# EAGLE design tea_maker_without_autorouter (EAGLE 7.3.0)
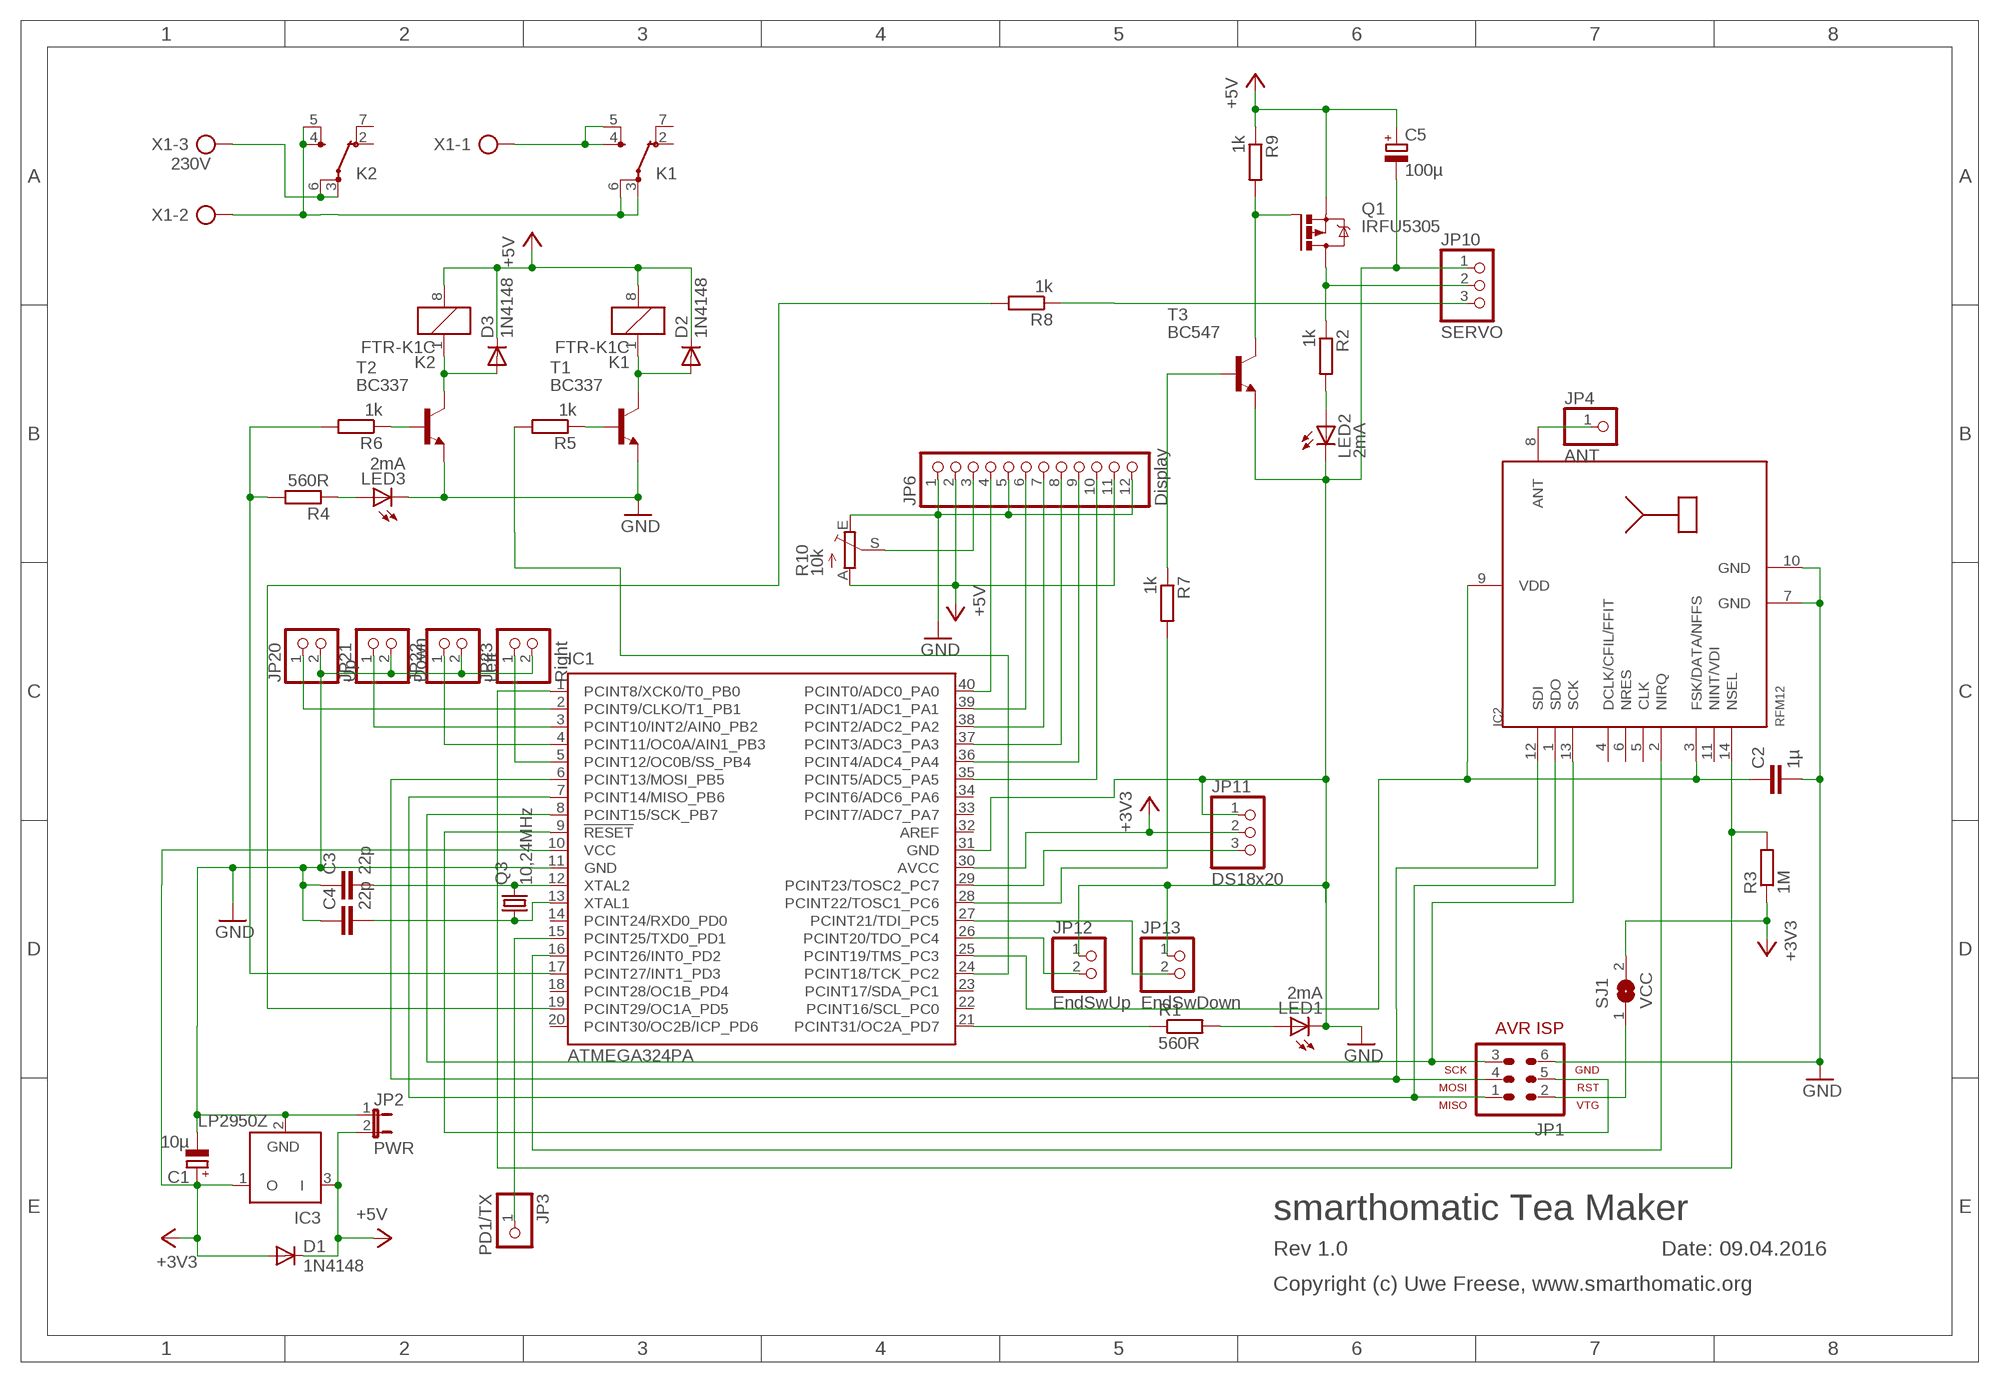
[diagram p0: schematic, sheet 1]

## Parts
C1  10µ  CPOL-EUE1.8-4  [E1,8-4]
C2  1µ  C5/3.5  [C5B3.5]
C3  22p  C-EU025-024X044  [C025-024X044]
C4  22p  C-EU025-024X044  [C025-024X044]
C5  100µ  CPOL-EUE2.5-7  [E2,5-7]
D1  1N4148  1N4148DO35-7  [DO35-7]
D2  1N4148  1N4148DO35-7  [DO35-7]
D3  1N4148  1N4148DO35-7  [DO35-7]
IC1  ATMEGA324PA  ATMEGA644-10PU  [DIL40]
IC2  RFM12  [RFM]
IC3  LP2950Z  [TO92]
JP1  AVR-ISP-6  [AVR-ISP-6]
JP2  PWR  JP1E  [JP1]
JP3  PD1/TX  PINHD-1X1  [1X01]
JP4  ANT  PINHD-1X1  [1X01]
JP6  Display  PINHD-1X12  [1X12]
JP10  SERVO  PINHD-1X3  [1X03]
JP11  DS18x20  PINHD-1X3  [1X03]
JP12  EndSwUp  PINHD-1X2  [1X02]
JP13  EndSwDown  PINHD-1X2  [1X02]
JP20  Up  PINHD-1X2  [1X02]
JP21  Down  PINHD-1X2  [1X02]
JP22  Left  PINHD-1X2  [1X02]
JP23  Right  PINHD-1X2  [1X02]
K1  FTR-K1C  [FTR-K1C]
K2  FTR-K1C  [FTR-K1C]
LED1  2mA  LED3MM  [LED3MM]
LED2  2mA  LED3MM  [LED3MM]
LED3  2mA  LED3MM  [LED3MM]
Q1  IRFU5305  [I-PAK_TO251AA]
Q3  10,24MHz  CRYSTALHC49S  [HC49/S]
R1  560R  R-EU_0207/7  [0207/7]
R2  1k  R-EU_0207/7  [0207/7]
R3  1M  R-EU_0207/7  [0207/7]
R4  560R  R-EU_0207/7  [0207/7]
R5  1k  R-EU_0207/7  [0207/7]
R6  1k  R-EU_0207/7  [0207/7]
R7  1k  R-EU_0207/7  [0207/7]
R8  1k  R-EU_0207/7  [0207/7]
R9  1k  R-EU_0207/7  [0207/7]
R10  10k  TRIM_EU-PT10S  [PT-10S]
SJ1  VCC  SJ  [SJ]
T1  BC337  [TO92]
T2  BC337  [TO92]
T3  BC547  [TO92]
X1  230V  AK500/3  [AK500/3]

## Nets
+3V3: C1.+ D1.A IC1.10(VCC) IC1.30(AVCC) IC3.1(O) JP11.2 R3.1 SJ1.2
+5V: C5.+ D1.C D2.C D3.C IC3.3(I) JP2.2 JP6.2 JP6.11 K1.8 K2.8 Q1.3(S) R9.1 R10.A
GND: C1.- C2.2 C3.1 C4.1 C5.- IC1.11(GND) IC1.31(GND) IC2.7(GND) IC2.10(GND) IC3.2(GND) JP1.6 JP2.1 JP6.1 JP6.5 JP6.12 JP10.1 JP11.1 JP12.1 JP13.1 JP20.2 JP21.2 JP22.2 JP23.2 LED1.K(C) LED2.K(C) LED3.K(C) R10.E T1.1(E) T2.1(E) T3.1(E)
N$1: IC1.2(PCINT9/CLKO/T1_PB1) JP20.1
N$2: JP1.2 SJ1.1
N$3: IC1.6(PCINT13/MOSI_PB5) IC2.12(SDI) JP1.4
N$4: IC1.7(PCINT14/MISO_PB6) IC2.1(SDO) JP1.1
N$5: IC1.8(PCINT15/SCK_PB7) IC2.13(SCK) JP1.3
N$6: IC1.21(PCINT31/OC2A_PD7) R1.1
N$7: R5.1 T1.2(B)
N$8: IC1.9(!RESET) JP1.5
N$9: D2.A K1.1 T1.3(C)
N$10: IC1.3(PCINT10/INT2/AIN0_PB2) JP21.1
N$11: IC2.8(ANT) JP4.1
N$12: LED1.A R1.2
N$13: IC1.1(PCINT8/XCK0/T0_PB0) IC2.14(NSEL) R3.2
N$14: LED3.A R4.1
N$15: IC1.16(PCINT26/INT0_PD2) IC2.2(NIRQ)
N$16: IC1.4(PCINT11/OC0A/AIN1_PB3) JP22.1
N$17: IC1.5(PCINT12/OC0B/SS_PB4) JP23.1
N$18: K1.4(-1:SA) K1.5(-1:SB) X1.1
N$19: IC1.40(PCINT0/ADC0_PA0) JP6.4
N$20: IC1.15(PCINT25/TXD0_PD1) JP3.1
N$21: K2.3(-1:PA) K2.6(-1:PB) X1.3
N$22: C2.1 IC1.25(PCINT19/TMS_PC3) IC2.3(FSK/DATA/NFFS) IC2.9(VDD)
N$23: IC1.39(PCINT1/ADC1_PA1) JP6.6
N$25: IC1.24(PCINT18/TCK_PC2) R5.2
N$26: R6.1 T2.2(B)
N$27: IC1.38(PCINT2/ADC2_PA2) JP6.7
N$28: IC1.37(PCINT3/ADC3_PA3) JP6.8
N$29: IC1.36(PCINT4/ADC4_PA4) JP6.9
N$30: IC1.35(PCINT5/ADC5_PA5) JP6.10
N$31: LED2.A R2.2
N$32: IC1.28(PCINT22/TOSC1_PC6) R7.2
N$33: JP6.3 R10.S
N$34: R7.1 T3.2(B)
N$35: Q1.1(G) R9.2 T3.3(C)
N$36: JP10.2 Q1.2(D) R2.1
N$37: K1.3(-1:PA) K1.6(-1:PB) K2.4(-1:SA) K2.5(-1:SB) X1.2
N$38: JP10.3 R8.1
N$39: IC1.19(PCINT29/OC1A_PD5) R8.2
N$40: C3.2 IC1.12(XTAL2) Q3.2
N$41: C4.2 IC1.13(XTAL1) Q3.1
N$42: IC1.29(PCINT23/TOSC2_PC7) JP11.3
N$45: D3.A K2.1 T2.3(C)
N$47: IC1.26(PCINT20/TDO_PC4) JP12.2
N$48: IC1.17(PCINT27/INT1_PD3) R4.2 R6.2
N$49: IC1.27(PCINT21/TDI_PC5) JP13.2
Unconnected: IC1.14(PCINT24/RXD0_PD0) IC1.18(PCINT28/OC1B_PD4) IC1.20(PCINT30/OC2B/ICP_PD6) IC1.22(PCINT16/SCL_PC0) IC1.23(PCINT17/SDA_PC1) IC1.32(AREF) IC1.33(PCINT7/ADC7_PA7) IC1.34(PCINT6/ADC6_PA6) IC2.4(DCLK/CFIL/FFIT) IC2.5(CLK) IC2.6(NRES) IC2.11(NINT/VDI) K1.2(-1:OA) K1.7(-1:OB) K2.2(-1:OA) K2.7(-1:OB)

## Notes on the sheet
- smarthomatic Tea Maker
- Rev 1.0 | Date: 09.04.2016
- Copyright (c) Uwe Freese, www.smarthomatic.org

## Library data of the parts
C1 C5 = rcl:CPOL-EU: POLARIZED CAPACITOR, European symbol
C2 = capacitor-wima:C: CAPACITOR naming: grid - package width
C3 C4 = rcl:C-EU: CAPACITOR, European symbol
D1-D3 = diode:1N4148: DIODE high speed (Philips)
IC1 = atmel:ATMEGA644-*PU: 8-bit Microcontroller with 64K Bytes In-System Programmable Flash Auto generated by make-symbol-device-package-bsdl.ulp Rev. 34 Source: http://www.atmel.com/dyn/resources/prod_documents/doc2593.pdf; MPN: ATMEGA644V-10PU; OC_FARNELL: 1288342; OC_NEWARK: 23M5062
IC2 = hopeRF:RFM12
IC3 = linear:LP2950: 100 mA, Low Power Low Dropout Voltage Regulator Source: http://www.onsemi.com/pub/Collateral/LP2950-D.PDF
JP1 = avr-5-4.16:AVR-ISP-6: AVR ISP-6 Serial Programming Header
JP2 = jumper:JP1E: JUMPER
JP3 JP4 = pinhead:PINHD-1X1: PIN HEADER
JP6 = pinhead:PINHD-1X12: PIN HEADER
JP10 JP11 = pinhead:PINHD-1X3: PIN HEADER
JP12 JP13 JP20-JP23 = pinhead:PINHD-1X2: PIN HEADER
K1 K2 = relay:FTR-K1C: NETZRELAIS FTR-K1CK024W1XUM 16A/250VAC 1 Umschaltkontakt Distributor: Conrad Electronic Bestell Nr.: 504389-13 - 24V Source: http://www.produktinfo.conrad.com/datenblaetter/500000-524999/504384-da-01-de-NETZRELAIS_FTR_K1CK012W1XUM_16A_250VAC.pdf; OC_FARNELL: unknown; OC_NEWARK: unknown
LED1-LED3 = led:LED: LED OSRAM: - CHIPLED LG R971, LG N971, LY N971, LG Q971, LY Q971, LO R971, LY R971 LH N974, LH R974 LS Q976, LO Q976, LY Q976 LO Q996 - Hyper CHIPLED LW Q18S LB Q993, LB Q99A, LB R99A - SideLED LS A670, LO A670, LY A670, LG A670, LP A670 LB A673, LV A673, LT A673, LW A673 LH A674 LY A675 LS A676, LA A676, LO A676, LY A676, LW A676 LS A679, LY A679, LG A679 - Hyper Micro SIDELED® LS Y876, LA Y876, LO Y876, LY Y876 LT Y87S - SmartLED LW L88C, LW L88S LB L89C, LB L89S, LG L890 LS L89K, LO L89K, LY L89K LS L896, LA L896, LO L896, LY L896 - TOPLED LS T670, LO T670, LY T670, LG T670, LP T670 LSG T670, LSP T670, LSY T670, LOP T670, LYG T670 LG T671, LOG T671, LSG T671 LB T673, LV T673, LT T673, LW T673 LH T674 LS T676, LA T676, LO T676, LY T676, LB T676, LH T676, LSB T676, LW T676 LB T67C, LV T67C, LT T67C, LS T67K, LO T67K, LY T67K, LW E67C LS E67B, LA E67B, LO E67B, LY E67B, LB E67C, LV E67C, LT E67C LW T67C LS T679, LY T679, LG T679 LS T770, LO T770, LY T770, LG T770, LP T770 LB T773, LV T773, LT T773, LW T773 LH T774 LS E675, LA E675, LY E675, LS T675 LS T776, LA T776, LO T776, LY T776, LB T776 LHGB T686 LT T68C, LB T68C - Hyper Mini TOPLED® LB M676 - Mini TOPLED Santana® LG M470 LS M47K, LO M47K, LY M47K Source: http://www.osram.convergy.de LUXEON: - LUMILED® LXK2-PW12-R00, LXK2-PW12-S00, LXK2-PW14-U00, LXK2-PW14-V00 LXK2-PM12-R00, LXK2-PM12-S00, LXK2-PM14-U00 LXK2-PE12-Q00, LXK2-PE12-R00, LXK2-PE12-S00, LXK2-PE14-T00, LXK2-PE14-U00 LXK2-PB12-K00, LXK2-PB12-L00, LXK2-PB12-M00, LXK2-PB14-N00, LXK2-PB14-P00, LXK2-PB14-Q00 LXK2-PR12-L00, LXK2-PR12-M00, LXK2-PR14-Q00, LXK2-PR14-R00 LXK2-PD12-Q00, LXK2-PD12-R00, LXK2-PD12-S00 LXK2-PH12-R00, LXK2-PH12-S00 LXK2-PL12-P00, LXK2-PL12-Q00, LXK2-PL12-R00 Source: www.luxeon.com KINGBRIGHT: KA-3528ASYC Source: www.kingbright.com
Q1 = transistor-power:IRF?5305: HEXFET Power MOSFET Source: http://www.irf.com/product-info/datasheets/data/irfr5305pbf.pdf
Q3 = crystal:CRYSTAL: CRYSTAL; OC_FARNELL: 1667008; OC_NEWARK: unknown
R1-R9 = rcl:R-EU_: RESISTOR, European symbol
R10 = pot:TRIM_EU-: POTENTIOMETER
SJ1 = jumper:SJ: SMD solder JUMPER
T1 T2 = transistor-neu-to92:BC337: NPN TRANSISTOR
T3 = transistor-neu-to92:BC547: NPN TRANSISTOR
X1 = con-ptr500:AK500/3: CONNECTOR; OC_FARNELL: unknown; OC_NEWARK: unknown

## Net classes
0 default: clearance 0.305 mm

## Board
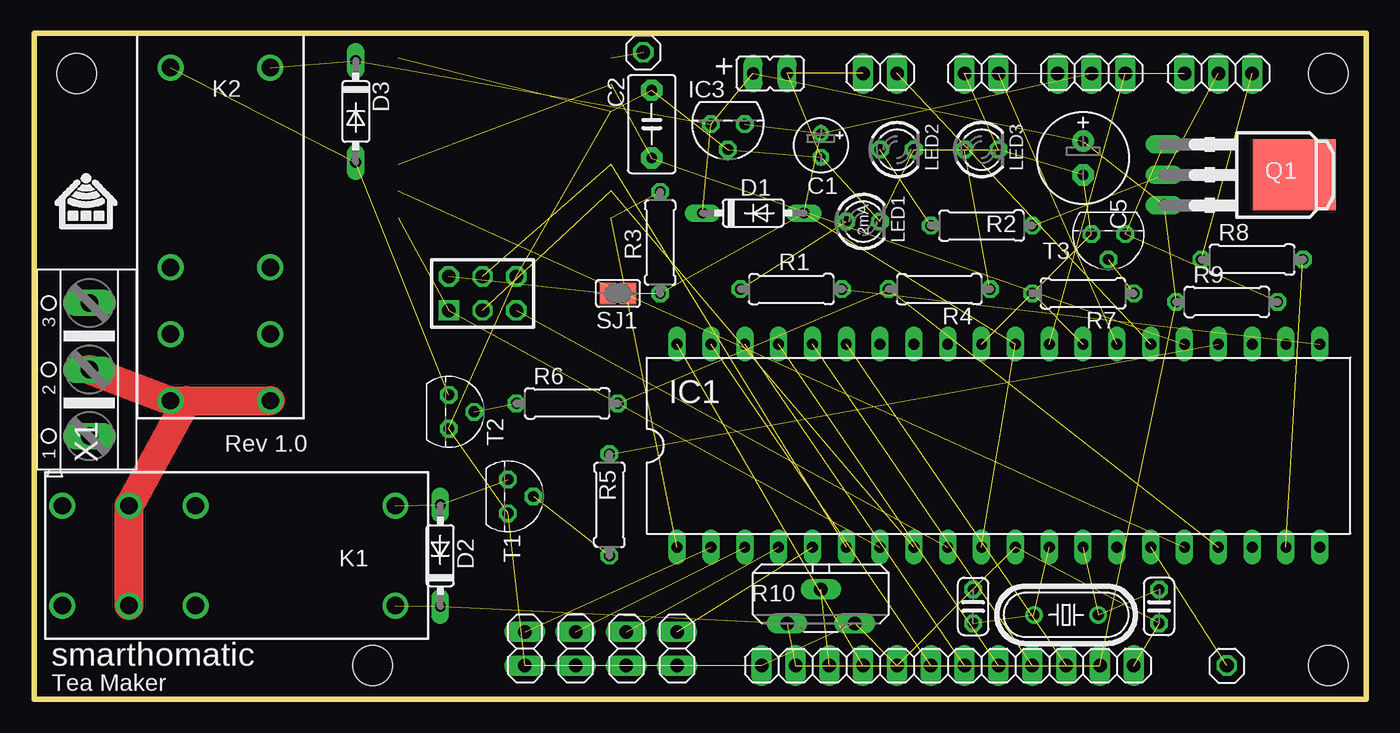
[diagram p1: board, top side]
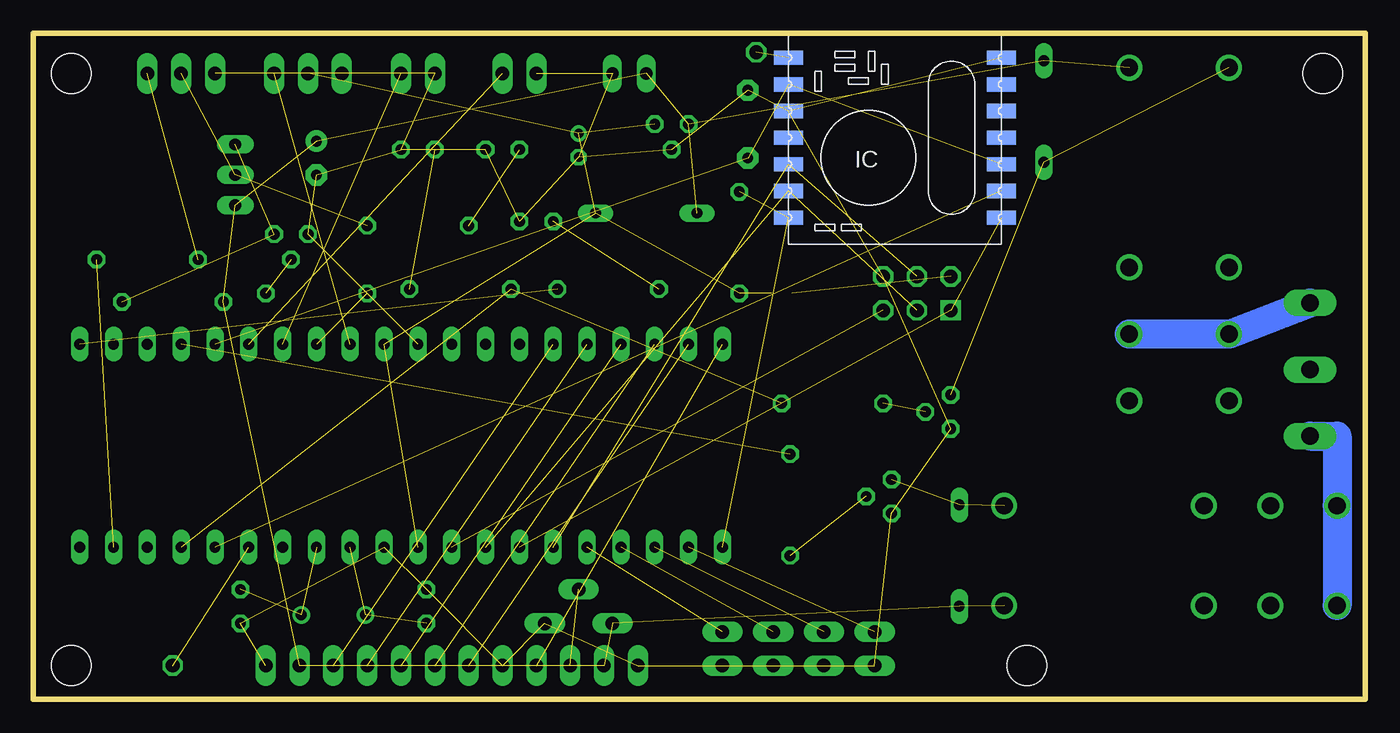
[diagram p2: board, bottom side, seen from below]

Size 100 x 50 mm. Coordinates in mm from the lower left corner, seen from the top.
Outline: 0,0 0,50 100,50 100,0 0,0
Copper layers (1*16): Top 0.035mm / dielectric 1.5mm / Bottom 0.035mm
Design rules "Fusion_eagle_rule_v1.1": minimum track width 6mil, minimum drill 12mil, track to track 6mil, track to pad 6mil, pad to pad 6mil, via to via 6mil, smd to smd 0mil, copper to edge 10mil, drill to drill 10mil, minimum pad ring 10mil, minimum via ring 6mil, stop-mask expansion 2mil, vias tented up to drill 100mil, thermal gap 10mil
Holes 3 mm at 3.17,46.99 97.16,46.99 97.16,2.54 25.4,2.54
tRestrict: area 0,0 to 25.4,40.6
bRestrict: area 0,0 to 25.4,40.6

### Footprints (pad centres in the part's own frame; a part is rotated, then mirrored left to right if it is on the bottom)
E1,8-4 = drill 0.711 pad 1.168: + -0.889,0 | drill 0.711 pad 1.168 octagon: - 0.889,0
C5B3.5 = drill 0.813 pad 1.6 octagon: 1 -2.54,0; 2 2.54,0
C025-024X044 = drill 0.813 octagon: 1 -1.27,0; 2 1.27,0
E2,5-7 = drill 0.813 pad 1.6: + -1.27,0 | drill 0.813 pad 1.6 octagon: - 1.27,0
DO35-7 = drill 0.813 long: A 3.81,0; C -3.81,0
DIL40 = drill 0.813 long: 1 -24.13,-7.62; 2 -21.59,-7.62; 3 -19.05,-7.62; 4 -16.51,-7.62; 5 -13.97,-7.62; 6 -11.43,-7.62; 7 -8.89,-7.62; 8 -6.35,-7.62; 9 -3.81,-7.62; 10 -1.27,-7.62; 11 1.27,-7.62; 12 3.81,-7.62; 13 6.35,-7.62; 14 8.89,-7.62; 15 11.43,-7.62; 16 13.97,-7.62; 17 16.51,-7.62; 18 19.05,-7.62; 19 21.59,-7.62; 20 24.13,-7.62; 21 24.13,7.62; 22 21.59,7.62; 23 19.05,7.62; 24 16.51,7.62; 25 13.97,7.62; 26 11.43,7.62; 27 8.89,7.62; 28 6.35,7.62; 29 3.81,7.62; 30 1.27,7.62; 31 -1.27,7.62; 32 -3.81,7.62; 33 -6.35,7.62; 34 -8.89,7.62; 35 -11.43,7.62; 36 -13.97,7.62; 37 -16.51,7.62; 38 -19.05,7.62; 39 -21.59,7.62; 40 -24.13,7.62
RFM = smd 2.184 x 1.067: 1 0,14; 2 0,12; 3 0,10; 4 0,8; 5 0,6; 6 0,4; 7 0,2; 8 16,2; 9 16,4; 10 16,6; 11 16,8; 12 16,10; 13 16,12; 14 16,14
TO92 = drill 0.813 octagon: 1 -1.27,0; 2 0,1.905; 3 1.27,0
AVR-ISP-6 = drill 1.016 square: 1 -2.54,-1.27 | drill 1.016 octagon: 2 -2.54,1.27; 3 0,-1.27; 4 0,1.27; 5 2.54,-1.27; 6 2.54,1.27
JP1 = drill 0.914 long: 1 0,-1.27; 2 0,1.27
1X01 = drill 1.016 octagon: 1 0,0
1X12 = drill 1.016 long: 1 -13.97,0; 2 -11.43,0; 3 -8.89,0; 4 -6.35,0; 5 -3.81,0; 6 -1.27,0; 7 1.27,0; 8 3.81,0; 9 6.35,0; 10 8.89,0; 11 11.43,0; 12 13.97,0
1X03 = drill 1.016 long: 1 -2.54,0; 2 0,0; 3 2.54,0
1X02 = drill 1.016 long: 1 -1.27,0; 2 1.27,0
FTR-K1C = drill 1.3 pad 1.93: 1 -12.5,-3.75; 2 2.5,-3.75; 3 7.5,-3.75; 4 12.5,-3.75; 5 12.5,3.75; 6 7.5,3.75; 7 2.5,3.75; 8 -12.5,3.75
LED3MM = drill 0.813 octagon: A -1.27,0; K 1.27,0
I-PAK_TO251AA = drill 0.889 long: 1 -2.286,-5.334; 2 0,-5.334; 3 2.286,-5.334 | smd 5.334 x 6.223: 4 0,4.445
HC49/S = drill 0.813: 1 -2.413,0; 2 2.413,0
0207/7 = drill 0.813 octagon: 1 -3.81,0; 2 3.81,0
PT-10S = drill 1.016 long: A -2.54,-1.27; E 2.54,-1.27; S 0,1.27
SJ = smd 1.168 x 1.6: 1 -0.762,0; 2 0.762,0
TO92' = drill 0.813 octagon: 1 1.27,0; 2 0,1.905; 3 -1.27,0
AK500/3 = drill 1.321 long: 1 -5.004,0; 2 0,0; 3 5.004,0

### Placement (x,y rotation side)
C1  59.05,41.59 270 top
C2  46.35,43.18 90 top
C3  70.48,6.99 270 top
C4  84.45,6.99 90 top
C5  78.74,40.64 270 top
D1  53.98,36.51 0 top
D2  30.48,10.79 90 top
D3  24.13,44.13 270 top
IC1  72.39,19.05 0 top
IC2  27.3,50.16 180 bottom
IC3  52.07,43.18 180 top
JP1  33.66,30.48 0 top
JP2  55.24,46.99 90 top
JP3  89.53,2.54 90 top
JP4  45.72,48.58 90 top
JP6  68.58,2.54 0 top
JP10  88.9,46.99 0 top
JP11  79.38,46.99 0 top
JP12  63.5,46.99 0 top
JP13  71.12,46.99 0 top
JP20  36.83,3.81 270 top
JP21  40.64,3.81 270 top
JP22  44.45,3.81 270 top
JP23  48.26,3.81 270 top
K1  14.61,10.79 180 top
K2  13.97,34.92 270 top
LED1  62.23,35.88 0 top
LED2  64.77,41.27 0 top
LED3  71.12,41.27 0 top
Q1  90.17,39.37 270 top
Q3  77.47,6.35 180 top
R1  56.83,30.8 180 top
R2  71.12,35.56 180 top
R3  46.99,34.29 90 top
R4  67.94,30.8 180 top
R5  43.18,14.61 90 top
R6  40.01,22.23 0 top
R7  78.74,30.48 180 top
R8  91.44,33.02 0 top
R9  89.53,29.84 0 top
R10  59.05,6.99 0 top
SJ1  43.81,30.48 0 top
T1  BC337  [TO92']  35.56,15.24 270 top
T2  BC337  [TO92']  31.11,21.59 270 top
T3  BC547  [TO92']  80.64,34.92 180 top
X1  4.13,24.77 90 top

### Tracks (layer width: path | path; a pad name or v marks a point on that pad's centre or on a via)
+3V3  (7 unrouted)
+5V  (12 unrouted)
GND  (29 unrouted)
N$1  (1 unrouted)
N$2  (1 unrouted)
N$3  (2 unrouted)
N$4  (2 unrouted)
N$5  (2 unrouted)
N$6  (1 unrouted)
N$7  (1 unrouted)
N$8  (1 unrouted)
N$9  (2 unrouted)
N$10  (1 unrouted)
N$11  (1 unrouted)
N$12  (1 unrouted)
N$13  (2 unrouted)
N$14  (1 unrouted)
N$15  (1 unrouted)
N$16  (1 unrouted)
N$17  (1 unrouted)
N$18
  Bottom 2.184: X1.1 2.1,19.76 K1.4 K1.5
N$19  (1 unrouted)
N$20  (1 unrouted)
N$21
  Bottom 2.184: K2.6 K2.3 X1.3
N$22  (3 unrouted)
N$23  (1 unrouted)
N$25  (1 unrouted)
N$26  (1 unrouted)
N$27  (1 unrouted)
N$28  (1 unrouted)
N$29  (1 unrouted)
N$30  (1 unrouted)
N$31  (1 unrouted)
N$32  (1 unrouted)
N$33  (1 unrouted)
N$34  (1 unrouted)
N$35  (2 unrouted)
N$36  (2 unrouted)
N$37
  Top 2.184: X1.2 K2.4 11.43,22.43 | 11.43,22.43 K2.5 | K1.6 K1.3 11.43,22.43
N$38  (1 unrouted)
N$39  (1 unrouted)
N$40  (2 unrouted)
N$41  (2 unrouted)
N$42  (1 unrouted)
N$45  (2 unrouted)
N$47  (1 unrouted)
N$48  (2 unrouted)
N$49  (1 unrouted)

### Text on the board
tNames: + | 2mA | Rev 1.0 | smarthomatic | Tea Maker